# Altium schematic sheet USB_Hub.SchDoc
size A3
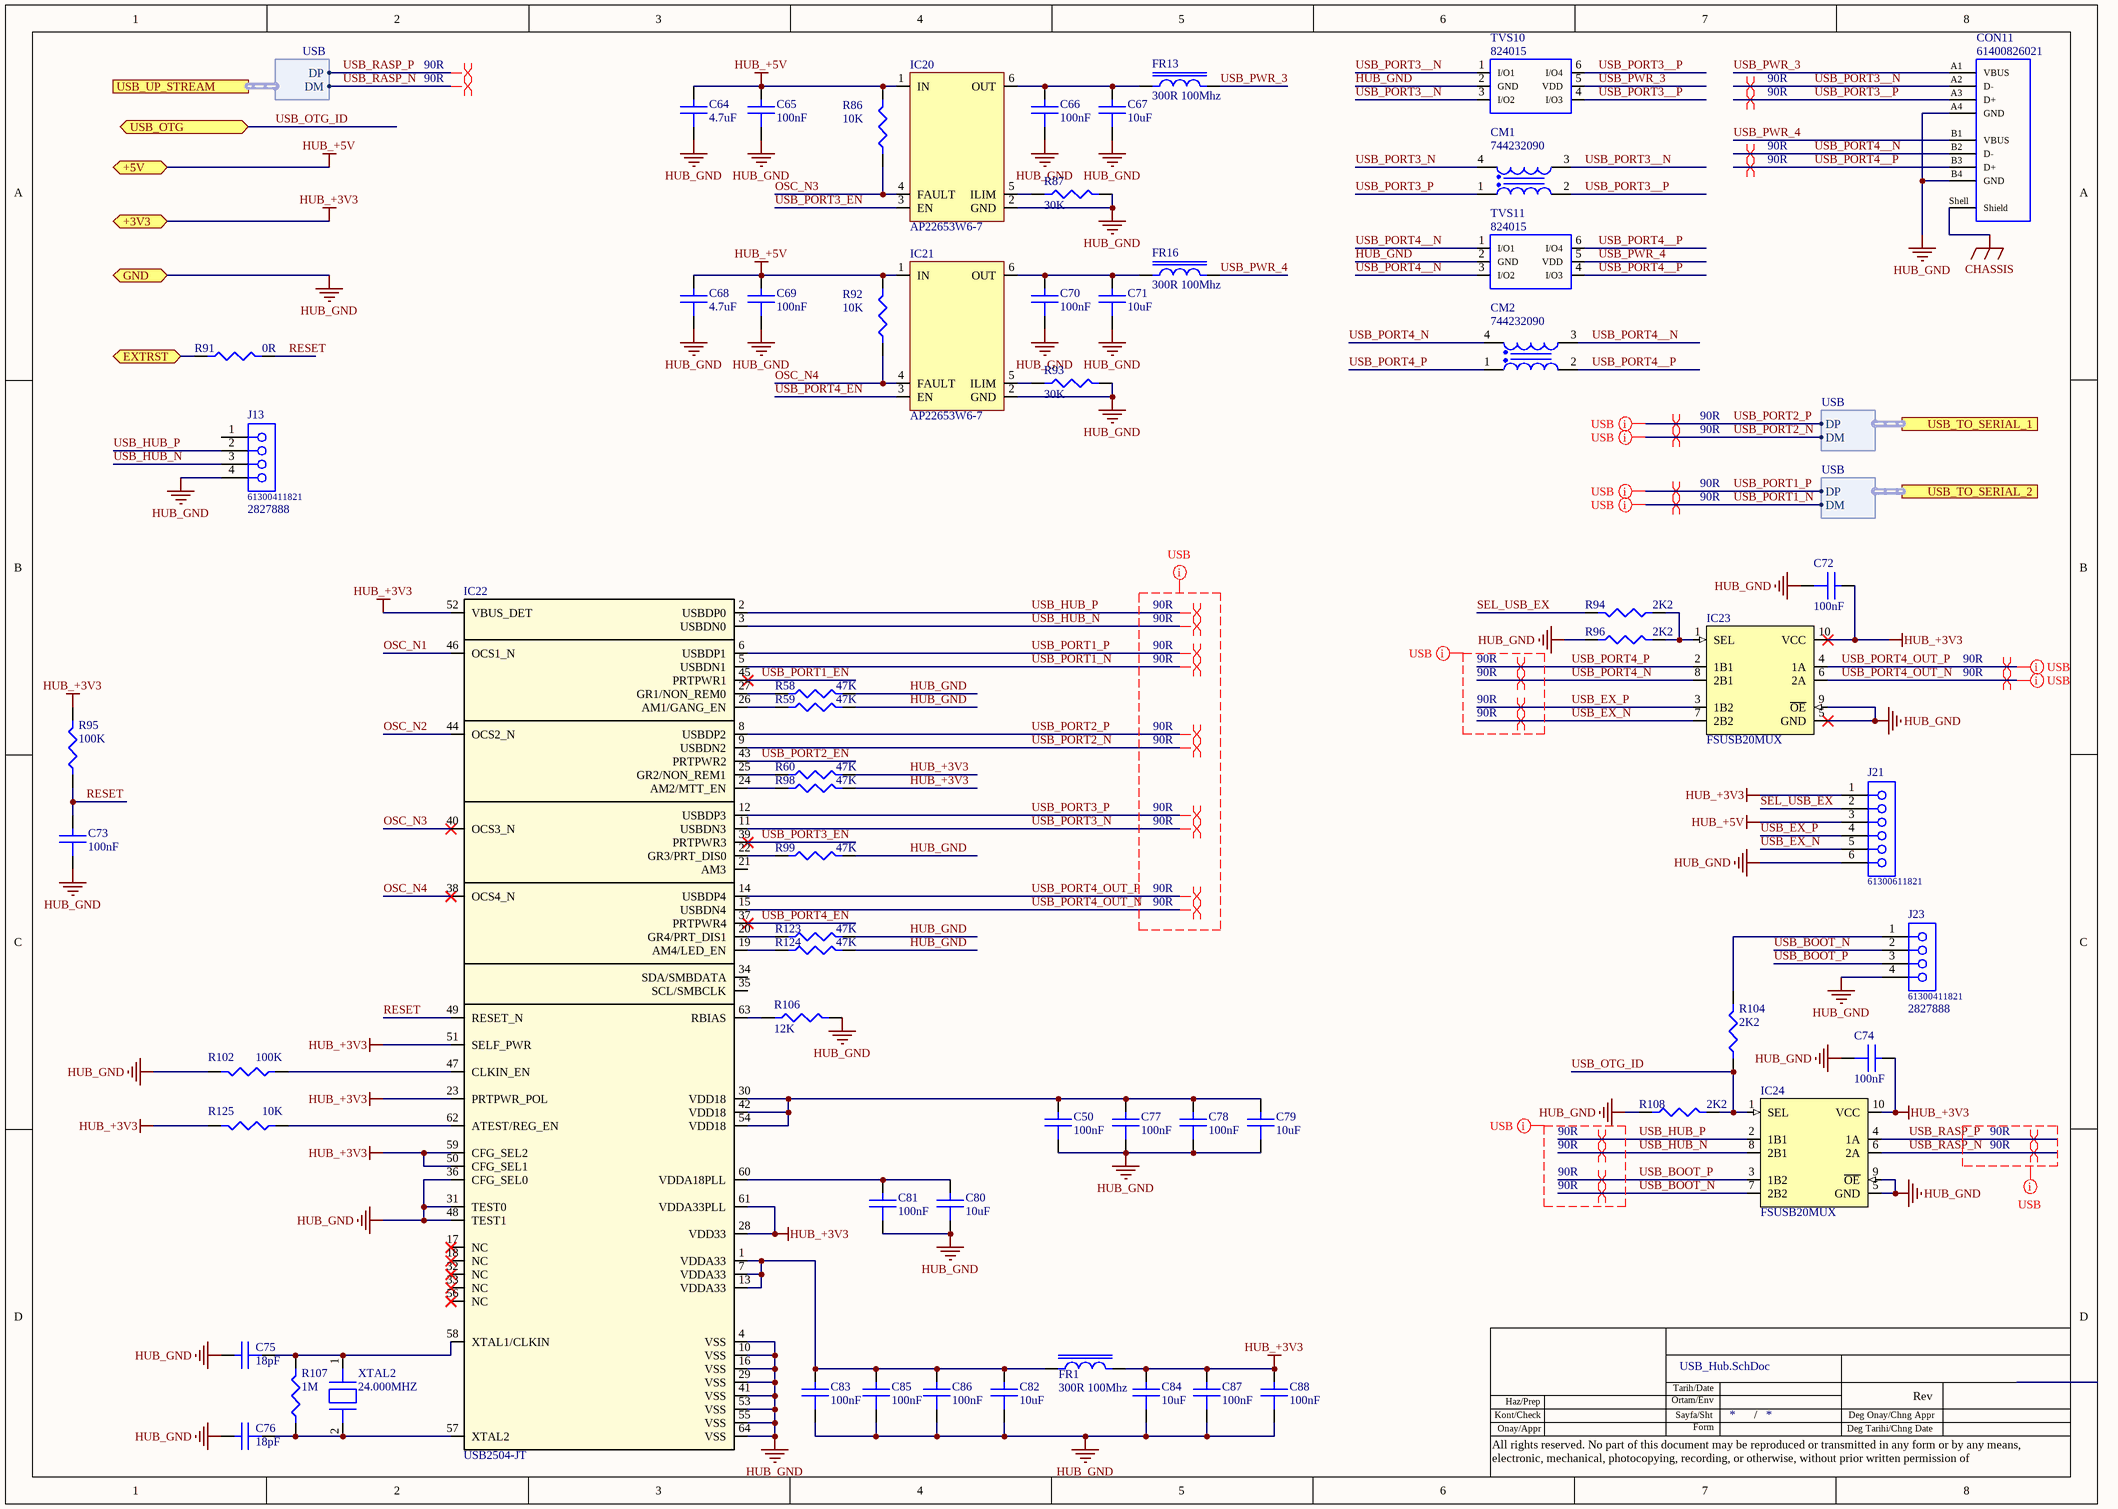
[diagram p0: USB_Hub.SchDoc]

## Parts
C50  100nF  [C0603]
C64  4.7uF  [C0603]
C65  100nF  [C0603]
C66  100nF  [C0603]
C67  10uF  [C0603]
C68  4.7uF  [C0603]
C69  100nF  [C0603]
C70  100nF  [C0603]
C71  10uF  [C0603]
C72  100nF  [C0603]
C73  100nF  [C0603]
C74  100nF  [C0603]
C75  18pF  [C0603]
C76  18pF  [C0603]
C77  100nF  [C0603]
C78  100nF  [C0603]
C79  10uF  [C0603]
C80  10uF  [C0603]
C81  100nF  [C0603]
C82  10uF  [C0603]
C83  100nF  [C0603]
C84  10uF  [C0603]
C85  100nF  [C0603]
C86  100nF  [C0603]
C87  100nF  [C0603]
C88  100nF  [C0603]
CM1  744232090  [WE-CNSW_1206]
CM2  744232090  [WE-CNSW_1206]
CON11  61400826021  [61400826021]
FR1  300R 100Mhz  [WE-CBF_0603_High Current]
FR13  300R 100Mhz  [WE-CBF_0603_High Current]
FR16  300R 100Mhz  [WE-CBF_0603_High Current]
IC20  AP22653W6-7  [SOT23-6]
IC21  AP22653W6-7  [SOT23-6]
IC22  USB2504-JT  [TQFP64]
IC23  FSUSB20MUX  [MSOP-10N]
IC24  FSUSB20MUX  [MSOP-10N]
J13  61300411821  Supplier Part Number 1: 2827888  [61300411821]
J21  61300611821  [61300611821]
J23  61300411821  Supplier Part Number 1: 2827888  [61300411821]
R58  47K  [R0603]
R59  47K  [R0603]
R60  47K  [R0603]
R86  10K  [R0603]
R87  30K  [R0603]
R91  0R  [R0603]
R92  10K  [R0603]
R93  30K  [R0603]
R94  2K2  [R0603]
R95  100K  [R0603]
R96  2K2  [R0603]
R98  47K  [R0603]
R99  47K  [R0603]
R102  100K  [R0603]
R104  2K2  [R0603]
R106  12K  [R0603]
R107  1M  [R0805]
R108  2K2  [R0603]
R123  47K  [R0603]
R124  47K  [R0603]
R125  10K  [R0603]
TVS10  824015  [SOT-23-6]
TVS11  824015  [SOT-23-6]
XTAL2  24.000MHZ  [CrystalSMD]

## Ports
+3V3 (bidir), +5V (bidir), EXTRST (bidir), GND (bidir), USB_OTG (bidir), USB_TO_SERIAL_1 (harness USB), USB_TO_SERIAL_2 (harness USB), USB_UP_STREAM (harness USB)

## Harnesses
USB: DP, DM

## Nets
CHASSIS: CON11.Shell(Shield)
HUB_+3V3: C72.1 C74.1 C84.1 C87.1 C88.1 FR1.2 IC22.23(PRTPWR_POL) IC22.28(VDD33) IC22.50(CFG_SEL1) IC22.51(SELF_PWR) IC22.52(VBUS_DET) IC22.59(CFG_SEL2) IC22.61(VDDA33PLL) IC23.10(VCC) IC24.10(VCC) J21.1 R60.2 R95.2 R98.2 R125.2 ; port +3V3
HUB_+5V: C64.1 C65.1 C68.1 C69.1 IC20.1(IN) IC21.1(IN) J21.3 R86.2 R92.2 ; port +5V
HUB_GND: C50.2 C64.2 C65.2 C66.2 C67.2 C68.2 C69.2 C70.2 C71.2 C72.2 C73.2 C74.2 C75.1 C76.1 C77.2 C78.2 C79.2 C80.2 C81.2 C82.2 C83.2 C84.2 C85.2 C86.2 C87.2 C88.2 CON11.A4(GND) CON11.B4(GND) IC20.2(GND) IC21.2(GND) IC22.4(VSS) IC22.10(VSS) IC22.16(VSS) IC22.29(VSS) IC22.31(TEST0) IC22.36(CFG_SEL0) IC22.41(VSS) IC22.48(TEST1) IC22.53(VSS) IC22.55(VSS) IC22.64(VSS) IC23.5(GND) IC23.9(~{OE}) IC24.5(GND) IC24.9(~{OE}) J13.4 J21.6 J23.4 R58.2 R59.2 R87.2 R93.2 R96.1 R99.2 R102.2 R106.2 R108.1 R123.2 R124.2 TVS10.2(GND) TVS11.2(GND) ; port GND
EXTRST: R91.1 ; port EXTRST
OSC_N1: IC22.46(OCS1_N)
OSC_N2: IC22.44(OCS2_N)
OSC_N3: IC20.4(FAULT) IC22.40(OCS3_N) R86.1
OSC_N4: IC21.4(FAULT) IC22.38(OCS4_N) R92.1
RESET: C73.1 IC22.49(RESET_N) R91.2 R95.1
SEL_USB_EX: J21.2 R94.2
USB_BOOT_N: IC24.7(2B2) J23.2
USB_BOOT_P: IC24.3(1B2) J23.3
USB_EX_N: IC23.7(2B2) J21.5
USB_EX_P: IC23.3(1B2) J21.4
USB_HUB_N: IC22.3(USBDN0) IC24.8(2B1) J13.3
USB_HUB_P: IC22.2(USBDP0) IC24.2(1B1) J13.2
USB_OTG_ID: IC24.1(SEL) R104.1 R108.2 ; port USB_OTG
USB_PORT1_EN: IC22.45(PRTPWR1)
USB_PORT1_N: IC22.5(USBDN1) ; port USB_TO_SERIAL_2.DM
USB_PORT1_P: IC22.6(USBDP1) ; port USB_TO_SERIAL_2.DP
USB_PORT2_EN: IC22.43(PRTPWR2)
USB_PORT2_N: IC22.9(USBDN2) ; port USB_TO_SERIAL_1.DM
USB_PORT2_P: IC22.8(USBDP2) ; port USB_TO_SERIAL_1.DP
USB_PORT3__N: CM1.3 CON11.A2(D-) TVS10.1(I/O1) TVS10.3(I/O2)
USB_PORT3__P: CM1.2 CON11.A3(D+) TVS10.4(I/O3) TVS10.6(I/O4)
USB_PORT3_EN: IC20.3(EN) IC22.39(PRTPWR3)
USB_PORT3_N: CM1.4 IC22.11(USBDN3)
USB_PORT3_P: CM1.1 IC22.12(USBDP3)
USB_PORT4__N: CM2.3 CON11.B2(D-) TVS11.1(I/O1) TVS11.3(I/O2)
USB_PORT4__P: CM2.2 CON11.B3(D+) TVS11.4(I/O3) TVS11.6(I/O4)
USB_PORT4_EN: IC21.3(EN) IC22.37(PRTPWR4)
USB_PORT4_N: CM2.4 IC23.8(2B1)
USB_PORT4_OUT_N: IC22.15(USBDN4) IC23.6(2A)
USB_PORT4_OUT_P: IC22.14(USBDP4) IC23.4(1A)
USB_PORT4_P: CM2.1 IC23.2(1B1)
USB_PWR_3: CON11.A1(VBUS) FR13.2 TVS10.5(VDD)
USB_PWR_4: CON11.B1(VBUS) FR16.2 TVS11.5(VDD)
USB_RASP_N: IC24.6(2A) ; port USB_UP_STREAM.DM
USB_RASP_P: IC24.4(1A) ; port USB_UP_STREAM.DP
NetC50_1: C50.1 C77.1 C78.1 C79.1 IC22.30(VDD18) IC22.42(VDD18) IC22.54(VDD18)
NetC66_1: C66.1 C67.1 FR13.1 IC20.6(OUT)
NetC70_1: C70.1 C71.1 FR16.1 IC21.6(OUT)
NetC75_2: C75.2 IC22.58(XTAL1/CLKIN) R107.2 XTAL2.1
NetC76_2: C76.2 IC22.57(XTAL2) R107.1 XTAL2.2
NetC80_1: C80.1 C81.1 IC22.60(VDDA18PLL)
NetC82_1: C82.1 C83.1 C85.1 C86.1 FR1.1 IC22.1(VDDA33) IC22.7(VDDA33) IC22.13(VDDA33)
NetIC20_5: IC20.5(ILIM) R87.1
NetIC21_5: IC21.5(ILIM) R93.1
NetIC22_19: IC22.19(AM4/LED_EN) R124.1
NetIC22_20: IC22.20(GR4/PRT_DIS1) R123.1
NetIC22_22: IC22.22(GR3/PRT_DIS0) R99.1
NetIC22_24: IC22.24(AM2/MTT_EN) R98.1
NetIC22_25: IC22.25(GR2/NON_REM1) R60.1
NetIC22_26: IC22.26(AM1/GANG_EN) R59.1
NetIC22_27: IC22.27(GR1/NON_REM0) R58.1
NetIC22_47: IC22.47(CLKIN_EN) R102.1
NetIC22_62: IC22.62(ATEST/REG_EN) R125.1
NetIC22_63: IC22.63(RBIAS) R106.1
NetIC23_1: IC23.1(SEL) R94.1 R96.2
NetJ23_1: J23.1 R104.2

Not connected (* = marked no-connect by the designer): IC22 17(NC)* 18(NC)* 21(AM3) 32(NC)* 33(NC)* 34(SDA/SMBDATA) 35(SCL/SMBCLK) 56(NC)*; J13 1

## Layout directives
differential pair; differential pair class 90R: USB_BOOT_N, USB_BOOT_P, USB_EX_N, USB_EX_P, USB_HUB_N, USB_HUB_P, USB_PORT1_N, USB_PORT1_P, USB_PORT2_N, USB_PORT2_P, USB_PORT3__N, USB_PORT3__P, USB_PORT3_N, USB_PORT3_P, USB_PORT4__N, USB_PORT4__P, USB_PORT4_N, USB_PORT4_OUT_N, USB_PORT4_OUT_P, USB_PORT4_P, USB_RASP_N, USB_RASP_P
net class USB: (no net found under the mark), USB_PORT1_N, USB_PORT1_P, USB_PORT2_N, USB_PORT2_P, USB_PORT4_OUT_N, USB_PORT4_OUT_P

## Notes on the sheet
- Tarih/Date
- Kont/Check
- Onay/Appr
- Haz/Prep
- Ortam/Env
- Sayfa/Sht
- Form
- /
- Deg Tarihi/Chng Date
- Deg Onay/Chng Appr
- Rev
- All rights reserved. No part of this document may be reproduced or transmitted in any form or by any means, electronic, mechanical, photocopying, recording, or otherwise, without prior written permission of

## Library data of the parts
C50 C65 C66 C69 C70 C72-C74 C77 C78 C81 C83 C85-C88 = CC0603KRX7R8BB104: 100nF, 25V, X7R, 10%, 0603; Manufacturer: Yageo; Supplier 1: Digi-Key; Supplier Part Number 1: 311-1341-1-ND; Manufacturer Part Number: CC0603KRX7R8BB104; Stock 1: 10150433; Pricing 1: 1 = 0,10000, 10 = 0,04500, 50 = 0,02480, 100 = 0,02020, 500 = 0,01444, 1000 = 0,01134 (USD); RoHS: Yes; Mount: Surface Mount; Case/Package: 0603; Number of Pins: 2; Case Code (Imperial): 0603; Case Code (Metric): 1608; Min Operating Temperature: -55°C; Max Operating Temperature: 125°C; Capacitance: 100nF; Tolerance: 10%; Voltage Rating: 25V; Packaging: Tape and Reel; Package Quantity: 1; Voltage Rating (DC): 25V; Dielectric: X7R; Termination: SMD/SMT; Resistor Type: Ceramic; Voltage: 25V; Length: 1.6mm; Width: 0.8mm; Height: 0.8mm; Thickness: 0.035inch; Depth: 0.8mm; Radiation Hardening: No; REACH SVHC: Unknown; Lead Free: Lead Free; Halogen Free: Halogen Free; ComponentLink1URL: https://datasheet.ciiva.com/11786/0900766b80c10176-11786120.pdf?src-supplier=RSComponents; ComponentLink1Description: https://datasheet.ciiva.com/11786/0900766b80c10176-11786120.pdf?src-supplier=RSComponents; ComponentLink2URL: https://datasheet.ciiva.com/144/mlccorderingcode-144075.pdf?src-supplier=Digi-Key; ComponentLink2Description: https://datasheet.ciiva.com/144/mlccorderingcode-144075.pdf?src-supplier=Digi-Key; ComponentLink3URL: https://datasheet.ciiva.com/17434/upy-gphc-x7r-6-3v-to-50v-8-17434263.pdf?src-supplier=Avnet+Europe; ComponentLink3Description: https://datasheet.ciiva.com/17434/upy-gphc-x7r-6-3v-to-50v-8-17434263.pdf?src-supplier=Avnet+Europe; ComponentLink4URL: https://datasheet.ciiva.com/26829/getdatasheetpartid-403577-26829431.pdf?src-supplier=Verical; ComponentLink4Description: https://datasheet.ciiva.com/26829/getdatasheetpartid-403577-26829431.pdf?src-supplier=Verical; ComponentLink5URL: https://datasheet.ciiva.com/11587/upy-gphc-x7r-6-3v-to-50v-8-11587208.pdf?src-supplier=Avnet; ComponentLink5Description: https://datasheet.ciiva.com/11587/upy-gphc-x7r-6-3v-to-50v-8-11587208.pdf?src-supplier=Avnet; ComponentLink6URL: https://datasheet.ciiva.com/13389/upy-gphc-x7r-6-3v-to-50v-8-13389352.pdf?src-supplier=Mouser; ComponentLink6Description: https://datasheet.ciiva.com/13389/upy-gphc-x7r-6-3v-to-50v-8-13389352.pdf?src-supplier=Mouser; ComponentLink7URL: https://datasheet.ciiva.com/28450/1489800-28450584.pdf?src-supplier=Element14; ComponentLink7Description: https://datasheet.ciiva.com/28450/1489800-28450584.pdf?src-supplier=Element14; ComponentLink8URL: https://datasheet.ciiva.com/144/mlccorderingcode-144073.pdf?src-supplier=Digi-Key; ComponentLink8Description: https://datasheet.ciiva.com/144/mlccorderingcode-144073.pdf?src-supplier=Digi-Key; ComponentLink9URL: https://datasheet.ciiva.com/144/mlccorderingcode-144074.pdf?src-supplier=Digi-Key; ComponentLink9Description: https://datasheet.ciiva.com/144/mlccorderingcode-144074.pdf?src-supplier=Digi-Key; ComponentLink10URL: https://datasheet.ciiva.com/7978/1489800-7978155.pdf?src-supplier=Element14; ComponentLink10Description: https://datasheet.ciiva.com/7978/1489800-7978155.pdf?src-supplier=Element14; Category: Capasitor
C64 C68 = CC0603MRX7R5BB475: 4.7uF 6.3V X7R 0603; Manufacturer: Yageo; Tolerance: 20%; Supplier 1: Digi-Key; Supplier Part Number 1: 311-3496-6-ND; Manufacturer Part Number: CC0603MRX7R5BB475; Stock 1: 5553; Pricing 1: 1 = 0,48000, 10 = 0,33600, 50 = 0,25420, 100 = 0,22130, 500 = 0,16394, 1000 = 0,13935 (USD); RoHS: No; Mount: Surface Mount; Case/Package: 0603; Case Code (Imperial): 0603; Case Code (Metric): 1608; Min Operating Temperature: -55°C; Max Operating Temperature: 125°C; Packaging: Cut Tape; Capacitance: 4.7uF; Voltage Rating: 6.3V; ComponentLink1URL: http://www.yageo.com/documents/recent/UPY-GPHC_X7R_6.3V-to-50V_18.pdf?src-supplier=Digi-Key; ComponentLink1Description: http://www.yageo.com/documents/recent/UPY-GPHC_X7R_6.3V-to-50V_18.pdf?src-supplier=Digi-Key; Category: Capasitor
C67 C71 C79 C80 C82 C84 = CC0603MRX5R6BB106: 10uF 10V X5R 20% SMD 0603 85C Paper T/R; Manufacturer: Yageo; Supplier 1: Digi-Key; Supplier Part Number 1: 311-1817-1-ND; Manufacturer Part Number: CC0603MRX5R6BB106; Stock 1: 209492; Pricing 1: 1 = 0,20000, 10 = 0,13700, 50 = 0,08200, 100 = 0,06920, 500 = 0,04736, 1000 = 0,04190 (USD); RoHS: Yes; Mount: Surface Mount; Case/Package: 0603; Case Code (Imperial): 0603; Case Code (Metric): 1608; Weight: 7.1E-05oz; Min Operating Temperature: -55°C; Max Operating Temperature: 85°C; Voltage Rating: 10V; Termination: SMD/SMT; Resistor Type: Ceramic; Dielectric: X5R; Tolerance: 20%; Packaging: Tape and Reel; Capacitance: 10uF; Voltage Rating (DC): 10V; Length: 0.063inch; Width: 0.031inch; Thickness: 0.035inch; Depth: 0.8mm; Lead Free: Lead Free; Halogen Free: Halogen Free; ComponentLink1URL: http://components.arrow.com/part/dataview/0323_03079270?src-supplier=Arrow+Europe; ComponentLink1Description: http://components.arrow.com/part/dataview/0323_03079270?src-supplier=Arrow+Europe; ComponentLink2URL: http://www.mouser.com/ds/2/447/UPY-GPHC_X5R_4V-to-50V_25-1131599.pdf?src-supplier=Mouser; ComponentLink2Description: http://www.mouser.com/ds/2/447/UPY-GPHC_X5R_4V-to-50V_25-1131599.pdf?src-supplier=Mouser; ComponentLink3URL: http://www.yageo.com/documents/recent/UPY-GPHC_X5R_4V-to-50V_25.pdf?src-supplier=Digi-Key; ComponentLink3Description: http://www.yageo.com/documents/recent/UPY-GPHC_X5R_4V-to-50V_25.pdf?src-supplier=Digi-Key; Category: Capasitor
C75 C76 = CC0603JRNPO9BN180: 18 pF, 50 V, 0603 ± 5%, C0G / NP0; Manufacturer: Yageo; Voltage Rating: 50V; Temperature Coefficient: 30ppm/°C; Insulation Resistance: 100GR; Supplier 1: Digi-Key; Supplier Part Number 1: 311-1061-1-ND; Manufacturer Part Number: CC0603JRNPO9BN180; Stock 1: 27569; Pricing 1: 1 = 0,10000, 10 = 0,04100, 50 = 0,02220, 100 = 0,01810, 500 = 0,01294, 1000 = 0,01016 (USD); RoHS: Yes; Mount: Surface Mount; Case/Package: 0603; Number of Pins: 2; Case Code (Metric): 1608; Case Code (Imperial): 0603; Min Operating Temperature: -55°C; Max Operating Temperature: 125°C; Capacitance: 18pF; Tolerance: 5%; Packaging: Tape and Reel; Voltage Rating (DC): 50V; Package Quantity: 1; Dielectric: C0G; Termination: SMD/SMT; Resistor Type: Ceramic; Length: 1.6mm; Width: 0.031inch; Height: 0.8mm; Thickness: 0.035inch; Depth: 0.8mm; Radiation Hardening: No; REACH SVHC: No SVHC; Lead Free: Lead Free; ComponentLink1URL: https://datasheet.ciiva.com/144/mlccorderingcode-144637.pdf?src-supplier=Digi-Key; ComponentLink1Description: https://datasheet.ciiva.com/144/mlccorderingcode-144637.pdf?src-supplier=Digi-Key; ComponentLink2URL: https://datasheet.ciiva.com/144/mlccorderingcode-144638.pdf?src-supplier=Digi-Key; ComponentLink2Description: https://datasheet.ciiva.com/144/mlccorderingcode-144638.pdf?src-supplier=Digi-Key; ComponentLink3URL: https://datasheet.ciiva.com/144/mlccorderingcode-144639.pdf?src-supplier=Digi-Key; ComponentLink3Description: https://datasheet.ciiva.com/144/mlccorderingcode-144639.pdf?src-supplier=Digi-Key; ComponentLink4URL: https://datasheet.ciiva.com/8033/1734582-8033733.pdf?src-supplier=Element14; ComponentLink4Description: https://datasheet.ciiva.com/8033/1734582-8033733.pdf?src-supplier=Element14; ComponentLink5URL: https://datasheet.ciiva.com/46430/1835847-46430152.pdf?src-supplier=Element14; ComponentLink5Description: https://datasheet.ciiva.com/46430/1835847-46430152.pdf?src-supplier=Element14; ComponentLink6URL: https://datasheet.ciiva.com/11587/upy-gp-np0-16v-to-50v-8-11587323.pdf?src-supplier=Avnet; ComponentLink6Description: https://datasheet.ciiva.com/11587/upy-gp-np0-16v-to-50v-8-11587323.pdf?src-supplier=Avnet; ComponentLink7URL: https://datasheet.ciiva.com/16625/upy-gp-np0-16v-to-50v-8-16625517.pdf?src-supplier=Avnet+Europe; ComponentLink7Description: https://datasheet.ciiva.com/16625/upy-gp-np0-16v-to-50v-8-16625517.pdf?src-supplier=Avnet+Europe; ComponentLink8URL: https://datasheet.ciiva.com/28450/1443161-28450477.pdf?src-supplier=Element14; ComponentLink8Description: https://datasheet.ciiva.com/28450/1443161-28450477.pdf?src-supplier=Element14; ComponentLink9URL: https://datasheet.ciiva.com/5425/upy-gp-np0-16v-to-50v-8-5425439.pdf?src-supplier=Mouser; ComponentLink9Description: https://datasheet.ciiva.com/5425/upy-gp-np0-16v-to-50v-8-5425439.pdf?src-supplier=Mouser; Category: Capasitor
CM1 CM2 = 744232090: Common Mode Chokes Dual 90Ohm 100MHz 370mA SMD T/R; Manufacturer: Wurth Electronics; Core Material: Ferrite; Number of Lines: 2; Tolerance: 25%; Voltage Rating: 50V; Resistance: 300mR; Inductance: 3.3H; Impedance: 90R; Supplier 1: Digi-Key; Supplier Part Number 1: 732-1469-1-ND; Manufacturer Part Number: 744232090; Stock 1: 24452; Pricing 1: 1 = 1,23000, 10 = 1,17600, 50 = 1,09800, 100 = 1,03900, 500 = 1,00000, 1000 = 0,82300 (USD); RoHS: Yes; Mount: Surface Mount; Case/Package: 1206; Weight: 0.001376oz; Min Operating Temperature: -40°C; Max Operating Temperature: 125°C; Package Quantity: 1; Packaging: Tape and Reel; Frequency: 100MHz; Current Rating: 370mA; Voltage Rating (DC): 50V; Max Current Rating: 370mA; Current: 370mA; DC Resistance (DCR): 300mR; Max DC Current: 370mA; Termination: SMD/SMT; Test Frequency: 100MHz; Length: 3.2mm; Width: 1.6mm; Height: 0.083inch; Depth: 1.6mm; REACH SVHC: No SVHC; Lead Free: Lead Free; ComponentLink1URL: https://datasheet.ciiva.com/1008/744232090-1008352.pdf?src-supplier=Digi-Key; ComponentLink1Description: https://datasheet.ciiva.com/1008/744232090-1008352.pdf?src-supplier=Digi-Key; ComponentLink2URL: https://datasheet.ciiva.com/4952/744232090-24424-4952291.pdf?src-supplier=Mouser; ComponentLink2Description: https://datasheet.ciiva.com/4952/744232090-24424-4952291.pdf?src-supplier=Mouser; ComponentLink3URL: https://datasheet.ciiva.com/1467/1735620-1467976.pdf?src-supplier=Element14; ComponentLink3Description: https://datasheet.ciiva.com/1467/1735620-1467976.pdf?src-supplier=Element14; ComponentLink4URL: https://datasheet.ciiva.com/11800/0900766b80595ce5-11800284.pdf?src-supplier=RSComponents; ComponentLink4Description: https://datasheet.ciiva.com/11800/0900766b80595ce5-11800284.pdf?src-supplier=RSComponents; ComponentLink5URL: https://datasheet.ciiva.com/14187/744232090-eng-tds-14187245.pdf?src-supplier=Distrelec; ComponentLink5Description: https://datasheet.ciiva.com/14187/744232090-eng-tds-14187245.pdf?src-supplier=Distrelec; Category: Filters Common Mode Chokes
CON11 = 61400826021: CONN RCPT USB2.0 TYPEA STACK R/A; Manufacturer: Wurth Electronics; Gender: Female; Connector Type: USB,Socket; Number of Ports: 2; Number of Contacts: 8; Current Rating: 1A; Voltage Rating: 30V; Insulation Resistance: 1GR; Supplier 1: Digi-Key; Supplier Part Number 1: 732-2107-ND; Manufacturer Part Number: 61400826021; Stock 1: 5632; Pricing 1: 1 = 1,98000, 10 = 1,74700, 50 = 1,64600, 100 = 1,47800, 250 = 1,34400 (USD); RoHS: Yes; Mount: Through Hole,Horizontal; Contact Plating: Gold; Contact Material: Copper Alloy; Color: White; Min Operating Temperature: -40°C; Max Operating Temperature: 105°C; Packaging: Tray; Package Quantity: 100; Termination: Solder; Orientation: Vertical; Number of Positions: 8; USB Standard: USB 2.0; Length: 15.34mm; Width: 17mm; REACH SVHC: Unknown; Flammability Rating: UL94 V-0; ComponentLink1URL: https://datasheet.ciiva.com/1098/1442185-1098931.pdf?src-supplier=Element14; ComponentLink1Description: https://datasheet.ciiva.com/1098/1442185-1098931.pdf?src-supplier=Element14; ComponentLink2URL: https://datasheet.ciiva.com/6743/61400826021-6743655.pdf?src-supplier=Newark; ComponentLink2Description: https://datasheet.ciiva.com/6743/61400826021-6743655.pdf?src-supplier=Newark; ComponentLink3URL: https://datasheet.ciiva.com/4598/61400826021-88262-4598792.pdf?src-supplier=Mouser; ComponentLink3Description: https://datasheet.ciiva.com/4598/61400826021-88262-4598792.pdf?src-supplier=Mouser; ComponentLink4URL: https://datasheet.ciiva.com/11731/0900766b81023ab8-11731306.pdf?src-supplier=RSComponents; ComponentLink4Description: https://datasheet.ciiva.com/11731/0900766b81023ab8-11731306.pdf?src-supplier=RSComponents; Category: Connectors, Interconnects- USB, DVI, HDMI Connectors
FR1 FR13 FR16 = 742792641: FERRITE BEAD 300 OHM 0603 1LN; Manufacturer: Wurth Electronics; Current Rating: 2A; Tolerance: 25%; Number of Lines: 1; DC Resistance (DCR): 150mR; Inductance: 18nH; Supplier 1: Digi-Key; Supplier Part Number 1: 732-1592-1-ND; Manufacturer Part Number: 742792641; Stock 1: 53671; Pricing 1: 1 = 0,17000, 50 = 0,16800, 100 = 0,15500, 500 = 0,14800, 1000 = 0,14100, 2000 = 0,13400 (USD); RoHS: Yes; Mount: Surface Mount; Case/Package: SMD/SMT; Weight: 0.000141oz; Core Material: Ferrite; Case Code (Metric): 1608; Case Code (Imperial): 0603; Material: Ferrite; Min Operating Temperature: -55°C; Max Operating Temperature: 125°C; Package Quantity: 1; Packaging: Tape and Reel; Impedance: 300R; Max Current Rating: 2A; Max DC Current: 2A; Termination: SMD/SMT; Test Frequency: 100MHz; Length: 1.6mm; Width: 0.8mm; Height: 0.8mm; Depth: 0.8mm; REACH SVHC: Unknown; Lead Free: Lead Free; ComponentLink1URL: https://datasheet.ciiva.com/1013/742792641-1013888.pdf?src-supplier=Digi-Key; ComponentLink1Description: https://datasheet.ciiva.com/1013/742792641-1013888.pdf?src-supplier=Digi-Key; ComponentLink2URL: https://datasheet.ciiva.com/4940/742792641-72209-4940450.pdf?src-supplier=Mouser; ComponentLink2Description: https://datasheet.ciiva.com/4940/742792641-72209-4940450.pdf?src-supplier=Mouser; ComponentLink3URL: https://datasheet.ciiva.com/1466/1705830-1466501.pdf?src-supplier=Element14; ComponentLink3Description: https://datasheet.ciiva.com/1466/1705830-1466501.pdf?src-supplier=Element14; ComponentLink4URL: https://datasheet.ciiva.com/11800/0900766b80d2e072-11800409.pdf?src-supplier=RSComponents; ComponentLink4Description: https://datasheet.ciiva.com/11800/0900766b80d2e072-11800409.pdf?src-supplier=RSComponents; ComponentLink5URL: https://datasheet.ciiva.com/1013/742792641-1013889.pdf?src-supplier=Digi-Key; ComponentLink5Description: https://datasheet.ciiva.com/1013/742792641-1013889.pdf?src-supplier=Digi-Key; ComponentLink6URL: https://datasheet.ciiva.com/1466/1705830-1466502.pdf?src-supplier=Element14; ComponentLink6Description: https://datasheet.ciiva.com/1466/1705830-1466502.pdf?src-supplier=Element14; Category: Filters - Ferrite Beads and Chips
IC20 IC21 = AP22653W6-7: Power Switch/Driver 1:1 P-Channel 2.1A SOT-23-6; Manufacturer: Diodes; Supplier 1: Digi-Key; Manufacturer Part Number: AP22653W6-7; Stock 1: 12659; Pricing 1: 1 = 0,42000, 10 = 0,35600, 25 = 0,33200, 100 = 0,24670, 250 = 0,20880, 500 = 0,19930, 1000 = 0,14710 (USD); RoHS: No; Supplier Part Number 1: 31-AP22653W6-7CT-ND; Category: Integrated Circuits - PMIC - Power Distribution Switches, Load Drivers
IC22 = USB2504-JT: Low Speed/Full Speed/High Speed Compatible 4 Port Hub USB 2.0 1.8V/3.3V 64-Pin TQFP; Manufacturer: Microchip; Data Rate: 480Mbps; Number of Transceivers: 3; Dual Supply Voltage: 3.3V; Min Supply Voltage: 3V; Max Supply Voltage: 3.6V; Interface: Serial; Operating Supply Current: 295mA; Number of Ports: 4; Supplier 1: Digi-Key; Manufacturer Part Number: USB2504-JT; Stock 1: 112; Pricing 1: 1 = 3,83000, 25 = 3,33000 (USD); RoHS: Yes; Mount: Surface Mount; Case/Package: TQFP; Number of Pins: 64; Min Operating Temperature: 0°C; Max Operating Temperature: 70°C; Packaging: Tray; Package Quantity: 160; Operating Supply Voltage: 3.3V; Series: *; Length: 10.2mm; Width: 10.2mm; Height: 1.45mm; Radiation Hardening: No; Lead Free: Lead Free; REACH SVHC: No SVHC; RoHS Compliant: Yes; ComponentLink1URL: https://datasheet.ciiva.com/6636/filehandler-aspxddocname-en562618-6636281.pdf?src-supplier=Digi-Key; ComponentLink1Description: https://datasheet.ciiva.com/6636/filehandler-aspxddocname-en562618-6636281.pdf?src-supplier=Digi-Key; Supplier Part Number 1: USB2504-JT-ND; Category: Integrated Circuits - Interface - Controllers
IC23 IC24 = FSUSB20MUX: FAIRCHILD SEMICONDUCTOR         FSUSB20MUX             USB Interface, Switch, USB 2.0, 3 V, 3.6 V, MSOP, 10 Pins; Manufacturer: ON Semiconductor / Fairchild; Number of Inputs: 4; Number of Outputs: 2; Number of Channels: 1; Min Supply Voltage: 3V; Max Supply Voltage: 3.6V; Data Rate: 480Mbps; Bandwidth: 750MHz; Propagation Delay: 0.25ns; On-State Resistance: 6.5R; Turn-On Delay Time: 4.8ns; Turn-Off Delay Time: 2.2ns; Supply Type: Single; Throw Configuration: DPST; Drain to Source Resistance: 4.5R; USB Standard: USB 2.0; Supplier 1: Digi-Key; Manufacturer Part Number: FSUSB20MUX; Stock 1: 7192; Pricing 1: 1 = 1,97000, 10 = 1,76700, 25 = 1,66720, 100 = 1,42040, 250 = 1,33368, 500 = 1,16698, 1000 = 1,10092 (USD); RoHS: Yes; Mount: Surface Mount; Case/Package: MSOP; Number of Pins: 10; Weight: 0.1125g; Min Operating Temperature: -40°C; Max Operating Temperature: 85°C; Packaging: Tape and Reel; Package Quantity: 4000; Number of Ports: 1; Termination: SMD/SMT; Radiation Hardening: No; REACH SVHC: No SVHC; Lead Free: Lead Free; RoHS Compliant: Yes; ComponentLink1URL: https://datasheet.ciiva.com/15127/getdatasheetpartid-194036-15127411.pdf?src-supplier=Verical; ComponentLink1Description: https://datasheet.ciiva.com/15127/getdatasheetpartid-194036-15127411.pdf?src-supplier=Verical; ComponentLink2URL: https://datasheet.ciiva.com/1561/1639818-1561411.pdf?src-supplier=Farnell; ComponentLink2Description: https://datasheet.ciiva.com/1561/1639818-1561411.pdf?src-supplier=Farnell; ComponentLink3URL: https://datasheet.ciiva.com/1505/1639818-1505277.pdf?src-supplier=Element14; ComponentLink3Description: https://datasheet.ciiva.com/1505/1639818-1505277.pdf?src-supplier=Element14; ComponentLink4URL: https://datasheet.ciiva.com/1504/1639818-1504943.pdf?src-supplier=Element14; ComponentLink4Description: https://datasheet.ciiva.com/1504/1639818-1504943.pdf?src-supplier=Element14; ComponentLink5URL: https://datasheet.ciiva.com/6638/fsusb20-6638645.pdf?src-supplier=Digi-Key; ComponentLink5Description: https://datasheet.ciiva.com/6638/fsusb20-6638645.pdf?src-supplier=Digi-Key; ComponentLink6URL: https://datasheet.ciiva.com/6638/fsusb20-6638599.pdf?src-supplier=Digi-Key; ComponentLink6Description: https://datasheet.ciiva.com/6638/fsusb20-6638599.pdf?src-supplier=Digi-Key; ComponentLink7URL: https://datasheet.ciiva.com/6638/fsusb20-6638650.pdf?src-supplier=Digi-Key; ComponentLink7Description: https://datasheet.ciiva.com/6638/fsusb20-6638650.pdf?src-supplier=Digi-Key; ComponentLink8URL: https://datasheet.ciiva.com/11576/fsusb20-11576253.pdf?src-supplier=Avnet; ComponentLink8Description: https://datasheet.ciiva.com/11576/fsusb20-11576253.pdf?src-supplier=Avnet; ComponentLink9URL: https://datasheet.ciiva.com/26228/fsusb20-26228270.pdf?src-supplier=Avnet+Europe; ComponentLink9Description: https://datasheet.ciiva.com/26228/fsusb20-26228270.pdf?src-supplier=Avnet+Europe; Supplier Part Number 1: FSUSB20MUXCT-ND; Category: Integrated Circuits - Interface - Analog Switches - Special Purpose
J13 J23 = 61300411821: WR-PHD Socket Header, THT, pitch 2.54mm, Single Row, Vertical, 4pin; Manufacturer: Wurth Electronics; Pin Number: 4; Gender: Female; Rated Current: 3A; Working Voltage: 250VAC; Withstanding Voltage: 500VAC; Contact Resistance: 20mOhm; ComponentLink1Description: Manufacturer; ComponentLink1URL: http://www.we-online.de; ComponentLink2Description: Datasheet; ComponentLink2URL: https://katalog.we-online.de/em/datasheet/6130xx11821.pdf; Part Number: 61300411821; Published Date: June 2019; Publisher: Wurth Elektronik; Pitch: 2.54mm; Operating Temperature: -40 to +125degC; Mounting Technology: THT; Packaging: Tray; Row Number: Single; Orientation: Vertical; Supplier 1: Farnell; Manufacturer Part Number: 61300411821; Stock 1: 57; Pricing 1: 10 = 0,36400, 100 = 0,32400, 500 = 0,30300, 1000 = 0,29300, 2500 = 0,28300, 5000 = 0,27700 (EUR); RoHS: No; Contact Material: Copper Alloy; Category: Connectors, Interconnects Rectangular Connectors
J21 = 61300611821: WR-PHD Socket Header, THT, pitch 2.54mm, Single Row, Vertical, 6pin; Manufacturer: Wurth Elektronik; Pin Number: 6; Gender: Female; Rated Current: 3A; Working Voltage: 250VAC; Withstanding Voltage: 500VAC; Contact Resistance: 20mOhm; ComponentLink1Description: Manufacturer; ComponentLink1URL: http://www.we-online.de; ComponentLink2Description: Datasheet; ComponentLink2URL: https://katalog.we-online.de/em/datasheet/6130xx11821.pdf; Part Number: 61300611821; Published Date: June 2019; Publisher: Wurth Elektronik; Pitch: 2.54mm; Operating Temperature: -40 to +125degC; Mounting Technology: THT; Packaging: Tray; Row Number: Single; Orientation: Vertical; Category: Connectors, Interconnects Rectangular Connectors
R58-R60 R98 R99 R123 R124 = RC0603FR-0747KL: 47K, 50V, 1/10W, 1%, 0603; Manufacturer: Yageo; Resistance: 47kR; Temperature Coefficient: 100ppm/°C; Power Rating: 100mW; Supplier 1: Digi-Key; Supplier Part Number 1: 311-47.0KHRCT-ND; Manufacturer Part Number: RC0603FR-0747KL; Stock 1: 4802381; Pricing 1: 1 = 0,10000, 10 = 0,02100, 100 = 0,00840, 1000 = 0,00379, 2500 = 0,00329 (USD); RoHS: Yes; Case/Package: 0603; Number of Pins: 2; Case Code (Metric): 1608; Case Code (Imperial): 0603; Min Operating Temperature: -55°C; Max Operating Temperature: 155°C; Tolerance: 1%; Packaging: Tape and Reel; Voltage Rating (DC): 50V; Resistor Type: Thick Film; Voltage Rating: 50V; Termination: SMD/SMT; Package Quantity: 1; Number of Terminations: 2; Max Power Dissipation: 100mW; Features: Moisture Resistant; Length: 1.6mm; Width: 0.031inch; Height: 0.022inch; Depth: 0.8mm; REACH SVHC: Unknown; Lead Free: Lead Free; Military Standard: Not; ComponentLink1URL: https://datasheet.ciiva.com/11808/0900766b80f96399-11808118.pdf?src-supplier=RSComponents; ComponentLink1Description: https://datasheet.ciiva.com/11808/0900766b80f96399-11808118.pdf?src-supplier=RSComponents; ComponentLink2URL: https://datasheet.ciiva.com/7746/443971-7746361.pdf?src-supplier=Element14; ComponentLink2Description: https://datasheet.ciiva.com/7746/443971-7746361.pdf?src-supplier=Element14; ComponentLink3URL: https://datasheet.ciiva.com/7746/443971-7746362.pdf?src-supplier=Element14; ComponentLink3Description: https://datasheet.ciiva.com/7746/443971-7746362.pdf?src-supplier=Element14; ComponentLink4URL: https://datasheet.ciiva.com/2453/pyu-r-int-thick-7-2453931.pdf?src-supplier=Digi-Key; ComponentLink4Description: https://datasheet.ciiva.com/2453/pyu-r-int-thick-7-2453931.pdf?src-supplier=Digi-Key; ComponentLink5URL: https://datasheet.ciiva.com/2453/pyu-r-int-thick-7-2453932.pdf?src-supplier=Digi-Key; ComponentLink5Description: https://datasheet.ciiva.com/2453/pyu-r-int-thick-7-2453932.pdf?src-supplier=Digi-Key; ComponentLink6URL: https://datasheet.ciiva.com/2453/pyu-r-int-thick-7-2453933.pdf?src-supplier=Digi-Key; ComponentLink6Description: https://datasheet.ciiva.com/2453/pyu-r-int-thick-7-2453933.pdf?src-supplier=Digi-Key; Category: Resistor
R86 R92 R125 = RT0603FRE0710KL: 10K OHM 1% 1/10W 0603; Manufacturer: Yageo; Resistance: 10kR; Power Rating: 100mW; Voltage Rating: 75V; Temperature Coefficient: 50ppm/°C; Supplier 1: Digi-Key; Supplier Part Number 1: YAG2321CT-ND; Manufacturer Part Number: RT0603FRE0710KL; Stock 1: 326134; Pricing 1: 1 = 0,10000, 10 = 0,05600, 100 = 0,02270, 1000 = 0,01020, 2500 = 0,00886 (USD); RoHS: Yes; Case/Package: 0603; Number of Pins: 2; Case Code (Metric): 1608; Case Code (Imperial): 0603; Contact Plating: Tin,Lead; Min Operating Temperature: -55°C; Max Operating Temperature: 125°C; Package Quantity: 5000; Packaging: Tape and Reel; Tolerance: 1%; Resistor Type: Thin Film; Number of Terminations: 2; Termination: SMD/SMT; Max Power Dissipation: 100mW; Voltage Rating (DC): 75V; Features: Moisture Resistant; Length: 0.063inch; Width: 0.031inch; Height: 0.022inch; Depth: 0.8mm; REACH SVHC: Unknown; Military Standard: Not; Lead Free: Lead Free; ComponentLink1URL: https://datasheet.ciiva.com/2559/pyu-rt-1-to-0-05-rohs-l-5-2559482.pdf?src-supplier=Digi-Key; ComponentLink1Description: https://datasheet.ciiva.com/2559/pyu-rt-1-to-0-05-rohs-l-5-2559482.pdf?src-supplier=Digi-Key; ComponentLink2URL: https://datasheet.ciiva.com/16745/pyu-rt-1-to-0-05-rohs-l-4-16745739.pdf?src-supplier=Future+Electronics; ComponentLink2Description: https://datasheet.ciiva.com/16745/pyu-rt-1-to-0-05-rohs-l-4-16745739.pdf?src-supplier=Future+Electronics; ComponentLink3URL: https://datasheet.ciiva.com/12694/pyu-rt-1-to-0-05-rohs-l-4-12694910.pdf?src-supplier=Mouser; ComponentLink3Description: https://datasheet.ciiva.com/12694/pyu-rt-1-to-0-05-rohs-l-4-12694910.pdf?src-supplier=Mouser; Category: Resistor
R87 R93 = RT0603FRE0730KL: 30K Ohm 1% 1/10W 0603; Manufacturer: Yageo; Resistance: 30kR; Power Rating: 100mW; Voltage Rating: 75V; Temperature Coefficient: 50ppm/°C; Voltage Rating (DC): 50V; Supplier 1: Digi-Key; Manufacturer Part Number: RT0603FRE0730KL; Stock 1: 2780; Pricing 1: 1 = 0,10000, 10 = 0,05600, 100 = 0,02270, 1000 = 0,01020, 2500 = 0,00886 (USD); RoHS: Yes; Case/Package: 0603; Case Code (Metric): 1608; Case Code (Imperial): 0603; Contact Plating: Tin,Matte; Size Code: 0603; Min Operating Temperature: -55°C; Max Operating Temperature: 125°C; Tolerance: 1%; Package Quantity: 5000; Packaging: Tape and Reel; Resistor Type: Thin Film; Number of Terminations: 2; Termination: SMD/SMT; Max Power Dissipation: 100mW; Series: RT; Length: 0.063inch; Width: 0.031inch; Height: 0.022inch; Radiation Hardening: No; Lead Free: Lead Free; RoHS Compliant: Yes; ComponentLink1URL: https://datasheet.ciiva.com/2559/pyu-rt-1-to-0-05-rohs-l-5-2559738.pdf?src-supplier=Digi-Key; ComponentLink1Description: https://datasheet.ciiva.com/2559/pyu-rt-1-to-0-05-rohs-l-5-2559738.pdf?src-supplier=Digi-Key; ComponentLink2URL: https://datasheet.ciiva.com/12703/pyu-rt-1-to-0-05-rohs-l-4-12703419.pdf?src-supplier=Mouser; ComponentLink2Description: https://datasheet.ciiva.com/12703/pyu-rt-1-to-0-05-rohs-l-4-12703419.pdf?src-supplier=Mouser; ComponentLink3URL: https://datasheet.ciiva.com/8889/pyu-rt-1-to-0-05-rohs-l-4-8889788.pdf?src-supplier=Avnet; ComponentLink3Description: https://datasheet.ciiva.com/8889/pyu-rt-1-to-0-05-rohs-l-4-8889788.pdf?src-supplier=Avnet; Supplier Part Number 1: 13-RT0603FRE0730KLCT-ND; Category: Resistor
R91 = RC0603FR-070RL: 0R, 1%, 0.1W, 0603; Manufacturer: Yageo; Resistance: 0mR; Power Rating: 100mW; Voltage Rating: 50V; Temperature Coefficient: 200ppm/°C; Current Rating: 1A; Working Voltage: 75V; Supplier 1: Digi-Key; Supplier Part Number 1: 311-0.0HRCT-ND; Manufacturer Part Number: RC0603FR-070RL; Stock 1: 513794; Pricing 1: 1 = 0,10000, 10 = 0,01800, 25 = 0,01280, 50 = 0,00980, 100 = 0,00730, 250 = 0,00552, 500 = 0,00442, 1000 = 0,00326 (USD); RoHS: Yes; Case/Package: 0603; Number of Pins: 2; Case Code (Metric): 1608; Case Code (Imperial): 0603; Contact Plating: Tin,Matte; Min Operating Temperature: -55°C; Max Operating Temperature: 155°C; Packaging: Tape and Reel; Package Quantity: 5000; Tolerance: 1%; Resistor Type: Thick Film; Number of Terminations: 2; Termination: SMD/SMT; Max Power Dissipation: 100mW; Voltage Rating (DC): 50V; Features: Moisture Resistant; Length: 1.6mm; Width: 0.031inch; Height: 0.45mm; Depth: 0.8mm; Radiation Hardening: No; REACH SVHC: No SVHC; Military Standard: Not; Lead Free: Lead Free; ComponentLink1URL: https://datasheet.ciiva.com/11808/0900766b80f96399-11808172.pdf?src-supplier=RSComponents; ComponentLink1Description: https://datasheet.ciiva.com/11808/0900766b80f96399-11808172.pdf?src-supplier=RSComponents; ComponentLink2URL: https://datasheet.ciiva.com/5558/rc0603-272842-5558341.pdf?src-supplier=Mouser; ComponentLink2Description: https://datasheet.ciiva.com/5558/rc0603-272842-5558341.pdf?src-supplier=Mouser; ComponentLink3URL: https://datasheet.ciiva.com/46382/443971-46382072.pdf?src-supplier=Element14; ComponentLink3Description: https://datasheet.ciiva.com/46382/443971-46382072.pdf?src-supplier=Element14; ComponentLink4URL: https://datasheet.ciiva.com/29721/pyu-r-int-thick-7-29721178.pdf?src-supplier=Digi-Key; ComponentLink4Description: https://datasheet.ciiva.com/29721/pyu-r-int-thick-7-29721178.pdf?src-supplier=Digi-Key; ComponentLink5URL: https://datasheet.ciiva.com/5684/443971-5684699.pdf?src-supplier=Farnell; ComponentLink5Description: https://datasheet.ciiva.com/5684/443971-5684699.pdf?src-supplier=Farnell; ComponentLink6URL: https://datasheet.ciiva.com/7983/443971-7983627.pdf?src-supplier=Element14; ComponentLink6Description: https://datasheet.ciiva.com/7983/443971-7983627.pdf?src-supplier=Element14; ComponentLink7URL: https://datasheet.ciiva.com/29721/pyu-rc0603-51-rohs-l-4-29721179.pdf?src-supplier=Digi-Key; ComponentLink7Description: https://datasheet.ciiva.com/29721/pyu-rc0603-51-rohs-l-4-29721179.pdf?src-supplier=Digi-Key; ComponentLink8URL: https://datasheet.ciiva.com/22643/1868787-22643388.pdf?src-supplier=Element14; ComponentLink8Description: https://datasheet.ciiva.com/22643/1868787-22643388.pdf?src-supplier=Element14; Category: Resistor
R94 R96 R104 R108 = RC0603FR-072K2L: 2K2, 1%, 0.1W, 0603; Manufacturer: Yageo; Resistance: 2.2kR; Power Rating: 100mW; Temperature Coefficient: 100ppm/°C; Voltage Rating: 50V; Supplier 1: Digi-Key; Supplier Part Number 1: 311-2.20KHRCT-ND; Manufacturer Part Number: RC0603FR-072K2L; Stock 1: 5062372; Pricing 1: 1 = 0,100000, 10 = 0,021000, 100 = 0,008400, 1000 = 0,003790, 2500 = 0,003290 (USD); RoHS: Yes; Case/Package: 0603; Case Code (Imperial): 0603; Case Code (Metric): 1608; Min Operating Temperature: -55°C; Max Operating Temperature: 155°C; Tolerance: 1%; Packaging: Tape and Reel; Package Quantity: 1; Termination: SMD/SMT; Resistor Type: Thick Film; Number of Terminations: 2; Max Power Dissipation: 100mW; Features: Moisture Resistant; Length: 1.6mm; Width: 0.031inch; Height: 0.022inch; Depth: 0.8mm; REACH SVHC: No SVHC; Lead Free: Lead Free; Military Standard: Not; ComponentLink1URL: https://datasheet.ciiva.com/46440/1868787-46440902.pdf?src-supplier=Element14; ComponentLink1Description: https://datasheet.ciiva.com/46440/1868787-46440902.pdf?src-supplier=Element14; ComponentLink2URL: https://datasheet.ciiva.com/2453/pyu-r-int-thick-7-2453943.pdf?src-supplier=Digi-Key; ComponentLink2Description: https://datasheet.ciiva.com/2453/pyu-r-int-thick-7-2453943.pdf?src-supplier=Digi-Key; ComponentLink3URL: https://datasheet.ciiva.com/7660/1868787-7660791.pdf?src-supplier=Element14; ComponentLink3Description: https://datasheet.ciiva.com/7660/1868787-7660791.pdf?src-supplier=Element14; ComponentLink4URL: https://datasheet.ciiva.com/2453/pyu-r-int-thick-7-2453944.pdf?src-supplier=Digi-Key; ComponentLink4Description: https://datasheet.ciiva.com/2453/pyu-r-int-thick-7-2453944.pdf?src-supplier=Digi-Key; ComponentLink5URL: https://datasheet.ciiva.com/2453/pyu-r-int-thick-7-2453945.pdf?src-supplier=Digi-Key; ComponentLink5Description: https://datasheet.ciiva.com/2453/pyu-r-int-thick-7-2453945.pdf?src-supplier=Digi-Key; ComponentLink6URL: https://datasheet.ciiva.com/7746/1738695-7746315.pdf?src-supplier=Element14; ComponentLink6Description: https://datasheet.ciiva.com/7746/1738695-7746315.pdf?src-supplier=Element14; ComponentLink7URL: https://datasheet.ciiva.com/7746/1738695-7746316.pdf?src-supplier=Element14; ComponentLink7Description: https://datasheet.ciiva.com/7746/1738695-7746316.pdf?src-supplier=Element14; ComponentLink8URL: https://datasheet.ciiva.com/46394/443971-46394958.pdf?src-supplier=Element14; ComponentLink8Description: https://datasheet.ciiva.com/46394/443971-46394958.pdf?src-supplier=Element14; Category: Resistor
R95 R102 = RC0603FR-07100KL: 100K Ohm 1% 1/10W 0603; Manufacturer: Yageo; Resistance: 100kR; Temperature Coefficient: 100ppm/°C; Voltage Rating (DC): 50V; Power Rating: 100mW; Working Voltage: 75V; Supplier 1: Digi-Key; Supplier Part Number 1: 311-100KHRCT-ND; Manufacturer Part Number: RC0603FR-07100KL; Stock 1: 10054915; Pricing 1: 1 = 0,10000, 10 = 0,02100, 100 = 0,00840, 1000 = 0,00379, 2500 = 0,00329 (USD); RoHS: Yes; Case/Package: 0603; Number of Pins: 2; Case Code (Imperial): 0603; Case Code (Metric): 1608; Min Operating Temperature: -55°C; Max Operating Temperature: 155°C; Tolerance: 1%; Packaging: Tape and Reel; Resistor Type: Thick Film; Voltage Rating: 50V; Termination: SMD/SMT; Number of Terminations: 2; Length: 1.6mm; Width: 0.8mm; Height: 0.45mm; Depth: 0.8mm; REACH SVHC: No SVHC; Lead Free: Lead Free; Military Standard: Not; ComponentLink1URL: https://datasheet.ciiva.com/11808/0900766b80f96399-11808107.pdf?src-supplier=RSComponents; ComponentLink1Description: https://datasheet.ciiva.com/11808/0900766b80f96399-11808107.pdf?src-supplier=RSComponents; ComponentLink2URL: https://datasheet.ciiva.com/7983/443971-7983593.pdf?src-supplier=Element14; ComponentLink2Description: https://datasheet.ciiva.com/7983/443971-7983593.pdf?src-supplier=Element14; ComponentLink3URL: https://datasheet.ciiva.com/46440/1868787-46440889.pdf?src-supplier=Element14; ComponentLink3Description: https://datasheet.ciiva.com/46440/1868787-46440889.pdf?src-supplier=Element14; ComponentLink4URL: https://datasheet.ciiva.com/7746/1738695-7746234.pdf?src-supplier=Element14; ComponentLink4Description: https://datasheet.ciiva.com/7746/1738695-7746234.pdf?src-supplier=Element14; ComponentLink5URL: https://datasheet.ciiva.com/7746/1738695-7746235.pdf?src-supplier=Element14; ComponentLink5Description: https://datasheet.ciiva.com/7746/1738695-7746235.pdf?src-supplier=Element14; ComponentLink6URL: https://datasheet.ciiva.com/22747/443971-22747516.pdf?src-supplier=Element14; ComponentLink6Description: https://datasheet.ciiva.com/22747/443971-22747516.pdf?src-supplier=Element14; Category: Resistor
R106 = RC0603FR-0712KL: 12 kohm, 0603, 75 V, 1/10 W; Manufacturer: Yageo; Resistance: 12kR; Tolerance: 1%; Power Rating: 100mW; Voltage Rating (DC): 50V; Temperature Coefficient: 100ppm/°C; Supplier 1: Digi-Key; Supplier Part Number 1: 311-12.0KHRCT-ND; Manufacturer Part Number: RC0603FR-0712KL; Stock 1: 979649; Pricing 1: 1 = 0,10000, 10 = 0,02100, 100 = 0,00840, 1000 = 0,00379, 2500 = 0,00329 (USD); RoHS: Yes; Case/Package: 0603; Number of Pins: 2; Case Code (Imperial): 0603; Case Code (Metric): 1608; Min Operating Temperature: -55°C; Max Operating Temperature: 155°C; Packaging: Tape and Reel; Voltage Rating: 50V; Termination: SMD/SMT; Resistor Type: Thick Film; Package Quantity: 1; Number of Terminations: 2; Max Power Dissipation: 100mW; Features: Moisture Resistant; Length: 0.063inch; Width: 0.031inch; Height: 0.022inch; Depth: 0.8mm; REACH SVHC: No SVHC; Lead Free: Lead Free; Military Standard: Not; Category: Resistor
R107 = RC0805JR-071ML: 1M Ohm 0805 5% 1/8W 100ppm/C; Manufacturer: Yageo; Resistance: 1MR; Power Rating: 125mW; Voltage Rating: 150V; Temperature Coefficient: 100ppm/°C; Supplier 1: Digi-Key; Manufacturer Part Number: RC0805JR-071ML; Stock 1: 699752; Pricing 1: 1 = 0,10000, 10 = 0,03100, 100 = 0,01270, 1000 = 0,00572, 2500 = 0,00497 (USD); RoHS: Yes; Case/Package: 0805; Case Code (Imperial): 0805; Case Code (Metric): 2012; Contact Plating: Tin,Lead,Matte; Min Operating Temperature: -55°C; Max Operating Temperature: 155°C; Tolerance: 5%; Packaging: Tape and Reel; Resistor Type: Thick Film; Package Quantity: 1; Termination: SMD/SMT; Number of Terminations: 2; Max Power Dissipation: 125mW; Features: Moisture Resistant; Length: 0.079inch; Width: 0.049inch; Height: 0.024inch; Depth: 1.25mm; Radiation Hardening: No; REACH SVHC: Unknown; Lead Free: Lead Free; Military Standard: Not; ComponentLink1URL: https://datasheet.ciiva.com/2519/pyu-r-int-thick-7-2519301.pdf?src-supplier=Digi-Key; ComponentLink1Description: https://datasheet.ciiva.com/2519/pyu-r-int-thick-7-2519301.pdf?src-supplier=Digi-Key; ComponentLink2URL: https://datasheet.ciiva.com/2519/pyu-r-int-thick-7-2519302.pdf?src-supplier=Digi-Key; ComponentLink2Description: https://datasheet.ciiva.com/2519/pyu-r-int-thick-7-2519302.pdf?src-supplier=Digi-Key; ComponentLink3URL: https://datasheet.ciiva.com/16796/rc0805-16796344.pdf?src-supplier=Future+Electronics; ComponentLink3Description: https://datasheet.ciiva.com/16796/rc0805-16796344.pdf?src-supplier=Future+Electronics; ComponentLink4URL: https://datasheet.ciiva.com/7941/442941-7941913.pdf?src-supplier=Element14; ComponentLink4Description: https://datasheet.ciiva.com/7941/442941-7941913.pdf?src-supplier=Element14; ComponentLink5URL: https://datasheet.ciiva.com/7941/442941-7941914.pdf?src-supplier=Element14; ComponentLink5Description: https://datasheet.ciiva.com/7941/442941-7941914.pdf?src-supplier=Element14; ComponentLink6URL: https://datasheet.ciiva.com/46395/444164-46395132.pdf?src-supplier=Element14; ComponentLink6Description: https://datasheet.ciiva.com/46395/444164-46395132.pdf?src-supplier=Element14; Supplier Part Number 1: 311-1.0MARCT-ND; Category: Resistor
TVS10 TVS11 = 824015: WURTH ELEKTRONIK - 824015 - TVS Diode, 82401 Series, Bidirectional, 5 V, 13 V, SOT-23, 6 Pins; Manufacturer: Wurth Electronics; Direction: Unidirectional; Capacitance: 2pF; Number of Bidirectional Channels: 4; Reverse Standoff Voltage: 5V; Min Breakdown Voltage: 6V; Clamping Voltage: 7.8V; Power Line Protection: Yes; Max Breakdown Voltage: 6.1V; Max Reverse Leakage Current: 5A; Test Current: 1mA; Max Surge Current: 12A; Peak Pulse Current: 4A; Supplier 1: Digi-Key; Supplier Part Number 1: 732-4467-1-ND; Manufacturer Part Number: 824015; Stock 1: 15203; Pricing 1: 1 = 0,85000, 10 = 0,80600, 50 = 0,75300, 100 = 0,69900, 500 = 0,61800 (USD); RoHS: Yes; Mount: Surface Mount; Case/Package: SOT-23; Number of Pins: 6; Min Operating Temperature: -55°C; Max Operating Temperature: 125°C; Package Quantity: 3000; Packaging: Tape and Reel; Polarity: Bidirectional; ESD Protection: Yes; Breakdown Voltage: 6.1V; Termination: SMD/SMT; Number of Channels: 4; Working Voltage: 5V; Operating Supply Voltage: 6V; Length: 2.9mm; Width: 2.8mm; Height: 1.16mm; REACH SVHC: Unknown; ComponentLink1URL: https://datasheet.ciiva.com/15063/824015-15063920.pdf?src-supplier=Digi-Key; ComponentLink1Description: https://datasheet.ciiva.com/15063/824015-15063920.pdf?src-supplier=Digi-Key; ComponentLink2URL: https://datasheet.ciiva.com/26308/824015-eng-tds-26308060.pdf?src-supplier=Distrelec; ComponentLink2Description: https://datasheet.ciiva.com/26308/824015-eng-tds-26308060.pdf?src-supplier=Distrelec; Category: Circuit Protection - TVS - Diodes
XTAL2 = ABLS-24.000MHZ-B2-T: CRYSTAL 24.0000MHZ 18PF SMD; Manufacturer: Abracon; Frequency: 24MHz; Frequency Tolerance: 20ppm; ESR (Equivalent Series Resistance): 40R; Frequency Stability: 50ppm; Supplier 1: Digi-Key; Manufacturer Part Number: ABLS-24.000MHZ-B2-T; Stock 1: 10538; Pricing 1: 1 = 0,50000, 10 = 0,41300, 50 = 0,37120, 100 = 0,33000, 500 = 0,31350 (USD); RoHS: Yes; Mount: Surface Mount; Case/Package: SMD/SMT; Number of Pins: 2; Contact Plating: Tin; Min Operating Temperature: -20°C; Max Operating Temperature: 70°C; Package Quantity: 1000; Load Capacitance: 18pF; Packaging: Tape and Reel; Tolerance: 20ppm; Termination: SMD/SMT; Series Resistance: 40R; Length: 11.4mm; Height: 0.165inch; Width: 0.185inch; Depth: 4.7mm; Radiation Hardening: No; REACH SVHC: No SVHC; Lead Free: Lead Free; ComponentLink1URL: https://datasheet.ciiva.com/26927/getdatasheetpartid-771243-26927969.pdf?src-supplier=Verical; ComponentLink1Description: https://datasheet.ciiva.com/26927/getdatasheetpartid-771243-26927969.pdf?src-supplier=Verical; ComponentLink2URL: https://datasheet.ciiva.com/15116/getdatasheetpartid-719917-15116794.pdf?src-supplier=Verical; ComponentLink2Description: https://datasheet.ciiva.com/15116/getdatasheetpartid-719917-15116794.pdf?src-supplier=Verical; ComponentLink3URL: https://datasheet.ciiva.com/854/abls-854291.pdf?src-supplier=Digi-Key; ComponentLink3Description: https://datasheet.ciiva.com/854/abls-854291.pdf?src-supplier=Digi-Key; ComponentLink4URL: https://datasheet.ciiva.com/854/abls-854292.pdf?src-supplier=Digi-Key; ComponentLink4Description: https://datasheet.ciiva.com/854/abls-854292.pdf?src-supplier=Digi-Key; ComponentLink5URL: https://datasheet.ciiva.com/854/abls-854293.pdf?src-supplier=Digi-Key; ComponentLink5Description: https://datasheet.ciiva.com/854/abls-854293.pdf?src-supplier=Digi-Key; ComponentLink6URL: https://datasheet.ciiva.com/3175/abls-3175381.pdf?src-supplier=Avnet; ComponentLink6Description: https://datasheet.ciiva.com/3175/abls-3175381.pdf?src-supplier=Avnet; ComponentLink7URL: https://datasheet.ciiva.com/7998/abls-7998426.pdf?src-supplier=Element14; ComponentLink7Description: https://datasheet.ciiva.com/7998/abls-7998426.pdf?src-supplier=Element14; ComponentLink8URL: https://datasheet.ciiva.com/16296/abls-16296138.pdf?src-supplier=Future+Electronics; ComponentLink8Description: https://datasheet.ciiva.com/16296/abls-16296138.pdf?src-supplier=Future+Electronics; Supplier Part Number 1: 535-9076-1-ND; Category: Crystals